# EAGLE design HoneyBee-V1.1 (EAGLE 6.5.0)
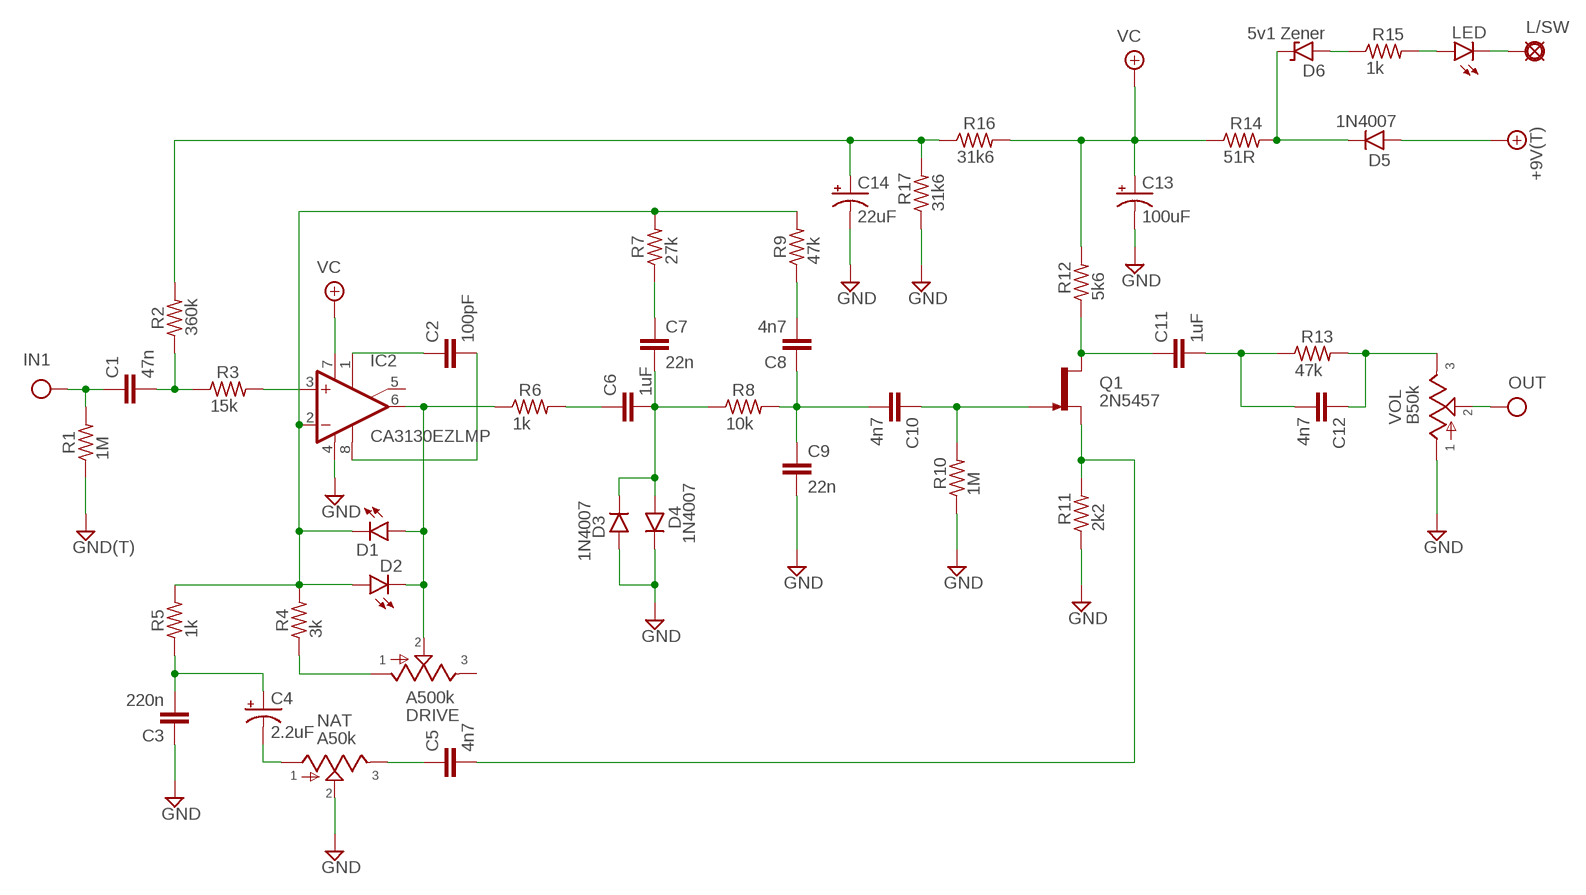
[diagram p0: schematic, sheet 1]

## Parts
+9V  +9V(T)  [SQUARE]
C1  47n  075X0402  [075X040]
C2  100pF  050X030_0251  [050X030_025]
C3  220n  080X0502  [080X050]
C4  2.2uF  0501  [050_020_1]
C5  4n7  070X0302  [070X030]
C6  1uF  080X0502  [080X050]
C7  22n  075X0302  [075X030]
C8  4n7  070X0302  [070X030]
C9  22n  075X0302  [075X030]
C10  4n7  070X0302  [070X030]
C11  1uF  080X0502  [080X050]
C12  4n7  070X0302  [070X030]
C13  100uF  0801  [080_035_1]
C14  22uF  0501  [050_020_1]
D1  LED3MM  [LED3MM]
D2  LED3MM  [LED3MM]
D3  1N4007  1N400X.3  [DO41-3]
D4  1N4007  1N400X.3  [DO41-3]
D5  1N4007  1N400X.3  [DO41-3]
D6  5v1 Zener  1N9ZENER  [DO35-3]
DRIVE  A500k  POT  [POT]
G1  GND(T)  [SQUARE]
IC2  CA3130EZLMP  [DIL08]
IN1  IN(T)  [SQUARE]
L/SW  PAD  [SQUARE]
LED  3mm  LED3MM  [LED3MM]
NAT  A50k  POT  [POT]
OUT  OUT(T)  [SQUARE]
Q1  2N5457  [TO92-]
R1  1M  6MM.3  [R0207/3]
R2  360k  6MM.3  [R0207/3]
R3  15k  6MM.3  [R0207/3]
R4  3k  6MM.3  [R0207/3]
R5  1k  6MM.3  [R0207/3]
R6  1k  6MM.3  [R0207/3]
R7  27k  6MM.3  [R0207/3]
R8  10k  6MM.3  [R0207/3]
R9  47k  6MM.3  [R0207/3]
R10  1M  6MM.3  [R0207/3]
R11  2k2  6MM.3  [R0207/3]
R12  5k6  6MM.3  [R0207/3]
R13  47k  6MM.3  [R0207/3]
R14  51R  6MM.3  [R0207/3]
R15  1k  6MM.3  [R0207/3]
R16  31k6  6MM.3  [R0207/3]
R17  31k6  6MM.3  [R0207/3]
VOL  B50k  POT  [POT]

## Nets
+9V: +9V.1(+9V) D5.A
GND: C3.1 C9.2 C13.- C14.- D3.A D4.C G1.1(GND) IC2.4(V-) NAT.2 R1.1 R10.1 R11.1 R17.1 VOL.1
IN: C1.1 IN1.1(IN) R1.2
N$1: C1.2 R2.1 R3.1
N$2: IC2.3(+IN) R3.2
N$3: C3.2 C4.+ R5.1
N$4: D1.K(C) D2.A IC2.2(-IN) R4.2 R5.2 R7.2 R9.2
N$5: C4.- NAT.1
N$6: C5.1 NAT.3
N$7: C6.1 R6.2
N$8: D1.A D2.K(C) DRIVE.2 IC2.6(OUT) R6.1
N$9: DRIVE.1 R4.1
N$10: C2.1 IC2.1(ON1)
N$11: C2.2 IC2.8(OPT)
N$12: C6.2 C7.2 D3.C D4.A R8.1
N$13: C7.1 R7.1
N$14: C8.1 C9.1 C10.2 R8.2
N$15: C8.2 R9.1
N$16: C10.1 Q1.1(G) R10.2
N$17: C5.2 Q1.2(S) R11.2
N$18: C11.1 Q1.3(D) R12.1
N$19: C14.+ R2.2 R16.1 R17.2
N$20: LED.A R15.2
N$21: C11.2 C12.2 R13.1
N$22: C12.1 R13.2 VOL.3
N$23: D5.C D6.C R14.2
N$24: D6.A R15.1
N$25: L/SW.1(PAD) LED.K(C)
OUT: OUT.1(OUT) VOL.2
VC: C13.+ IC2.7(V+) R12.2 R14.1 R16.2
Unconnected: DRIVE.3 IC2.5(ON2)

## Library data of the parts
+9V = mb_supply:+9V(T): +9V Voltage Supply use this to hook up +9v throughout a schematic instead of running wire automatically labels the net "+9v" adds a hookup pad to the circuit board
C1 = mb_caps-chicklet:075X040: 0.039 - 0.047uF Panasonic ECQ-B 7mm x 4mm 50V: 0.039 - 0.047uF;
C2 = mb_caps-ceramic:050X030_025: 47 - 120pF Xicon Ceramic Disc 2.5mm lead spacing
C3 C6 C11 = mb_caps-chicklet:080X050: 0.1uF Panasonic ECQ-B 8mm x 5mm
C4 C14 = mb_caps-electro:050: 0.22 - 100uF Xicon values at Mouser.com: 10V: 10 - 100uF; 16V: 2.2 - 47uF; 25V: 0.47 - 47uF; 50V: 0.22 - 22uF
C5 C8 C10 C12 = mb_caps-chicklet:070X030: 0.0001 - .01uF (100 - 10,000pF) Panasonic ECQ-B 7mm x 3mm 50 or 63V: 0.0001 - .01uF (100 - 10,000pF);
C7 C9 = mb_caps-chicklet:075X030: 0.015 - 0.022uF Panasonic ECQ-B 7.5mm x 3mm 50 or 63V: 0.015 - 0.022uF;
C13 = mb_caps-electro:080: 47 - 470uF Xicon values at Mouser.com 10V: 330, 470uF; 16V: 220, 330uF; 25V: 220uF; 50V: 47, 100uF
D1 D2 LED = mb_diodes:LED
D3-D5 = mb_diodes:1N400X: Rectifier Diodes often used in power supply to prevent damage from reverse polarization
D6 = mb_diodes:1N9*ZENER: 1N9???B Zener Diode DO-35 case 1N957B - 1N992B (6.8V to 200V)
DRIVE NAT VOL = mb_pots:POT: Potentiometers the arrow indicates the clockwise motion of th wiper (lug 2) fully counter clockwise there is no resistance between lugs 1 and 2 fully clockwise the resistance between lugs 1 and 2 is the value of the pot
G1 = mb_supply:GND(T): Ground use this to hook up ground (GND) throughout a schematic instead of running wire automatically labels the net "GND" adds a hookup pad to the circuit board (you can use several)
IC2 = mb_ics:CA3130EZ: OP AMP
IN1 = mb_supply:IN(T): Input obsolete: use Pad instead and label net shematic input label with circuit board terminal/pad generally used only once on a schematic (because this device labels the net "IN" in the same way as a voltage supply or ground net)
L/SW = mb_supply:PAD: PAD use this package for pads with any purpose, including input, output, send or return various pad shapes: round, square, octogonal, long, and long offset
OUT = mb_supply:OUT(T): Output obsolete: use Pad instead and label net output label with circuit board terminal/pad usually appears only once on a schematic
Q1 = mb_trans:2N5457: N-CHANNEL JFET
R1-R17 = mb_resistors:6MM: 6mm Resistors Leads spaced 1-6 holes apart for 0.1" perfboard. Suitable for 1/4 watt resistors.

## Board
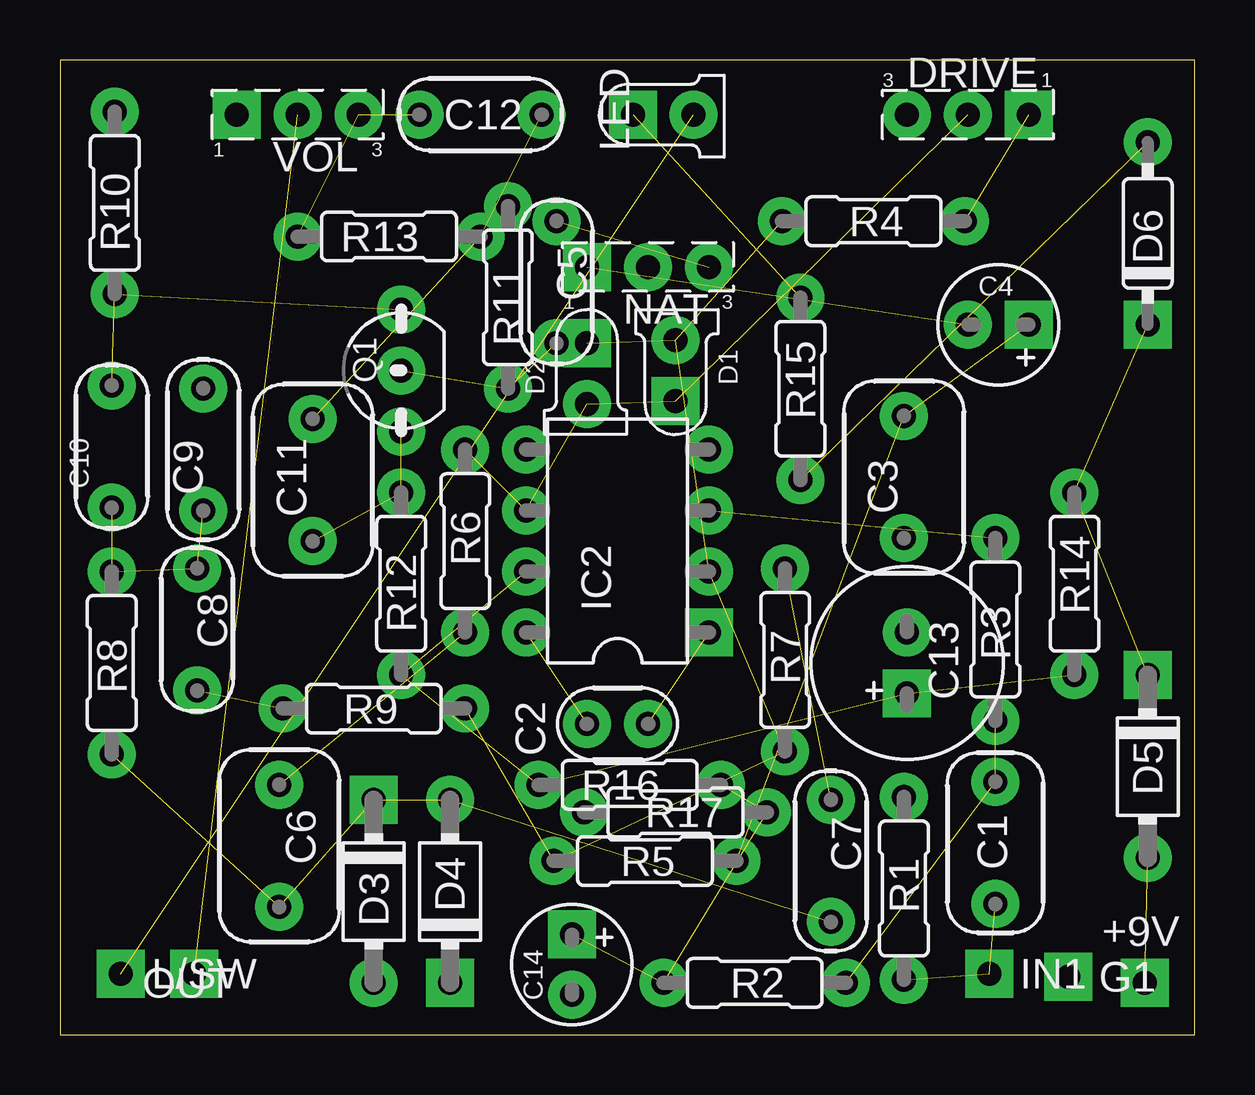
[diagram p1: board, top side]
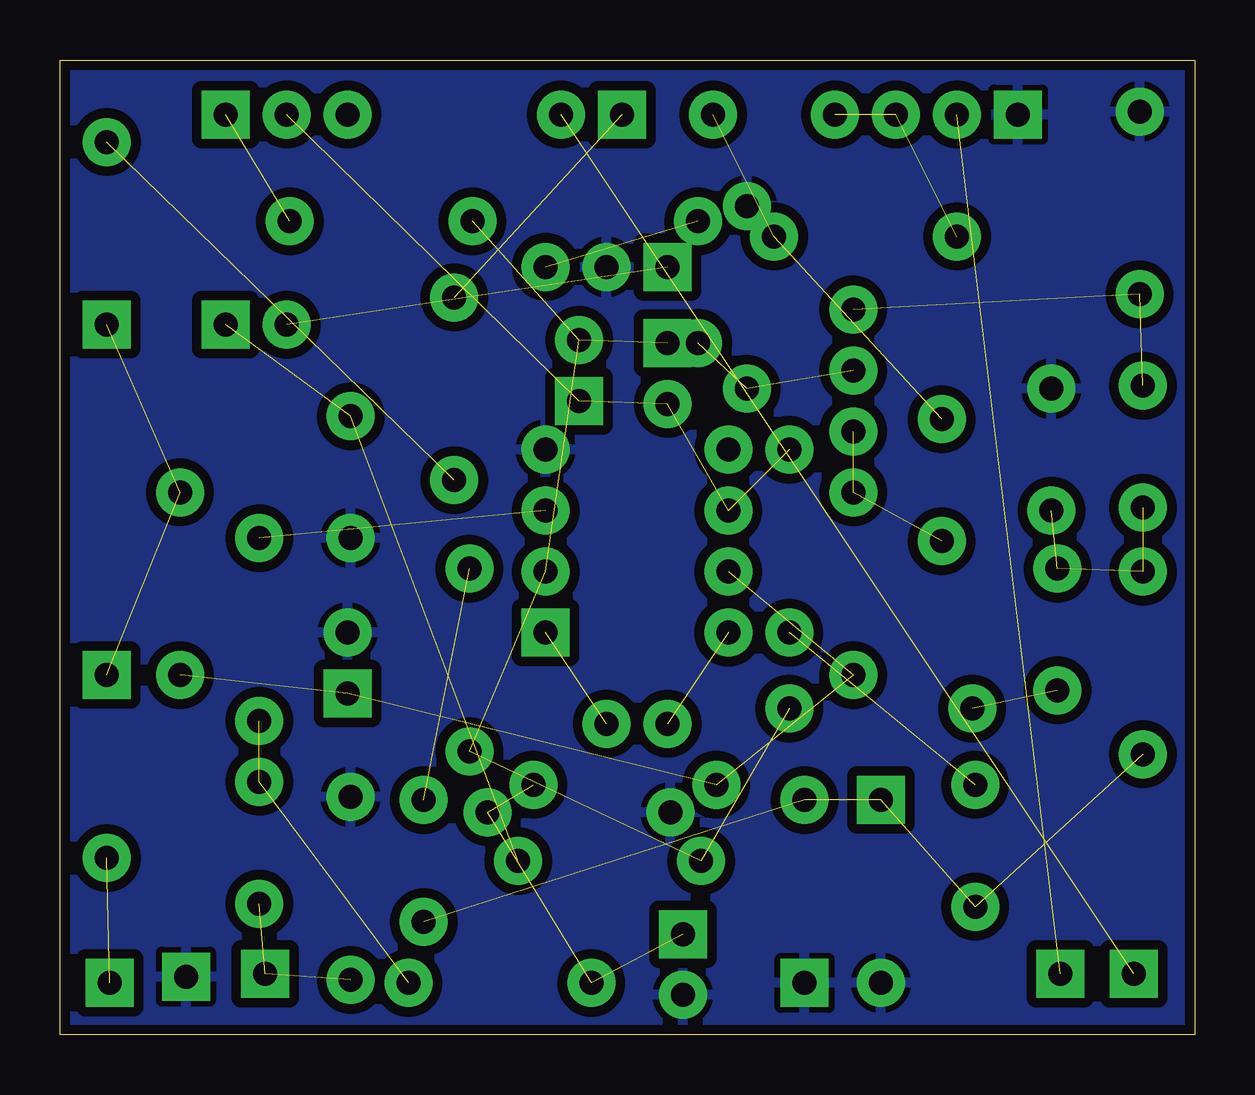
[diagram p2: board, bottom side, seen from below]

Size 47.3 x 40.63 mm. Coordinates in mm from the lower left corner, seen from the top.
Outline: 0,0 47.3,0 47.3,40.63 0,40.63 0,0
Copper layers (1*16): Top 0.0356mm / dielectric 1.5011mm / Bottom 0.0356mm
Design rules "LaenPCBOrder": minimum track width 6mil, minimum drill 13mil, track to track 6mil, track to pad 6mil, pad to pad 6mil, via to via 6mil, smd to smd 6mil, copper to edge 15mil, drill to drill 6mil, minimum pad ring 7mil, minimum via ring 7mil, stop-mask expansion 3mil, vias tented up to drill 0mil, thermal gap 10mil

### Footprints (pad centres in the part's own frame; a part is rotated, then mirrored left to right if it is on the bottom)
SQUARE = drill 1 pad 2 square: 1 0,0
075X040 = drill 1 pad 2: 1 -2.54,0; 2 2.54,0
050X030_025 = drill 1 pad 2: 1 -1.27,0; 2 1.27,0
080X050 = drill 1 pad 2: 1 -2.54,0; 2 2.54,0
050_020_1 = drill 1 pad 2 square: + -1.27,0 | drill 1 pad 2: - 1.27,0
070X030 = drill 1 pad 2: 1 -2.54,0; 2 2.54,0
075X030 = drill 1 pad 2: 1 -2.54,0; 2 2.54,0
080_035_1 = drill 1 pad 2 square: + -1.27,0 | drill 1 pad 2: - 1.27,0
LED3MM = drill 1 pad 2 square: A -1.27,0 | drill 1 pad 2: K 1.27,0
DO41-3 = drill 1 pad 2: A 3.81,0 | drill 1 pad 2 square: C -3.81,0
DO35-3 = drill 1 pad 2: A 3.81,0 | drill 1 pad 2 square: C -3.81,0
POT = drill 1 pad 2 square: 1 2.54,0 | drill 1 pad 2: 2 0,0; 3 -2.54,0
DIL08 = drill 1 pad 2 square: 1 -3.81,-3.81 | drill 1 pad 2: 2 -1.27,-3.81; 3 1.27,-3.81; 4 3.81,-3.81; 5 3.81,3.81; 6 1.27,3.81; 7 -1.27,3.81; 8 -3.81,3.81
TO92- = drill 1 pad 2: 1 2.54,0; 2 0,0; 3 -2.54,0
R0207/3 = drill 1 pad 2: 1 -3.81,0; 2 3.81,0

### Placement (x,y rotation side)
+9V  45.21,2.16 0 top
C1  38.99,8 90 top
C2  23.24,12.95 180 top
C3  35.18,23.24 90 top
C4  39.12,29.59 180 top
C5  20.7,31.37 270 top
C6  9.14,7.87 270 top
C7  32.13,7.24 270 top
C8  5.71,16.89 270 top
C9  5.97,24.38 90 top
C10  2.16,24.51 270 top
C11  10.54,23.11 90 top
C12  17.53,38.35 0 top
C13  35.31,15.49 90 top
C14  21.34,2.92 270 top
D1  25.65,27.69 90 top
D2  21.97,27.56 270 top
D3  13.08,5.97 270 top
D4  16.26,5.97 90 top
D5  45.34,11.18 270 top
D6  45.34,33.4 90 top
DRIVE  37.85,38.35 0 top
G1  42.04,2.41 0 top
IC2  23.24,20.57 90 top
IN1  38.73,2.54 0 top
L/SW  2.54,2.54 0 top
LED  25.15,38.35 0 top
NAT  24.51,32 180 top
OUT  5.59,2.54 0 top
Q1  14.22,27.69 90 top
R1  35.18,6.1 270 top
R2  28.96,2.16 180 top
R3  38.99,16.89 90 top
R4  33.91,33.91 180 top
R5  24.38,7.24 180 top
R6  16.89,20.57 270 top
R7  30.23,15.62 270 top
R8  2.16,15.49 90 top
R9  13.08,13.59 0 top
R10  2.29,34.67 270 top
R11  18.67,30.73 270 top
R12  14.22,18.8 270 top
R13  13.72,33.27 180 top
R14  42.29,18.8 90 top
R15  30.86,26.92 90 top
R16  23.75,10.41 180 top
R17  25.65,9.27 0 top
VOL  9.91,38.35 180 top

### Tracks (layer width: path | path; a pad name or v marks a point on that pad's centre or on a via)
+9V  (1 unrouted)
GND
  pour Bottom (isolate 0.406): 0,40.64 47.62,40.64 47.62,0 0,0
IN  (2 unrouted)
N$1  (2 unrouted)
N$2  (1 unrouted)
N$3  (2 unrouted)
N$4  (6 unrouted)
N$5  (1 unrouted)
N$6  (1 unrouted)
N$7  (1 unrouted)
N$8  (4 unrouted)
N$9  (1 unrouted)
N$10  (1 unrouted)
N$11  (1 unrouted)
N$12  (4 unrouted)
N$13  (1 unrouted)
N$14  (3 unrouted)
N$15  (1 unrouted)
N$16  (2 unrouted)
N$17  (2 unrouted)
N$18  (2 unrouted)
N$19  (3 unrouted)
N$20  (1 unrouted)
N$21  (2 unrouted)
N$22  (2 unrouted)
N$23  (2 unrouted)
N$24  (1 unrouted)
N$25  (1 unrouted)
OUT  (1 unrouted)
VC  (4 unrouted)